# Altium schematic sheet Overview.SchDoc
size A; SheetNumber: 1
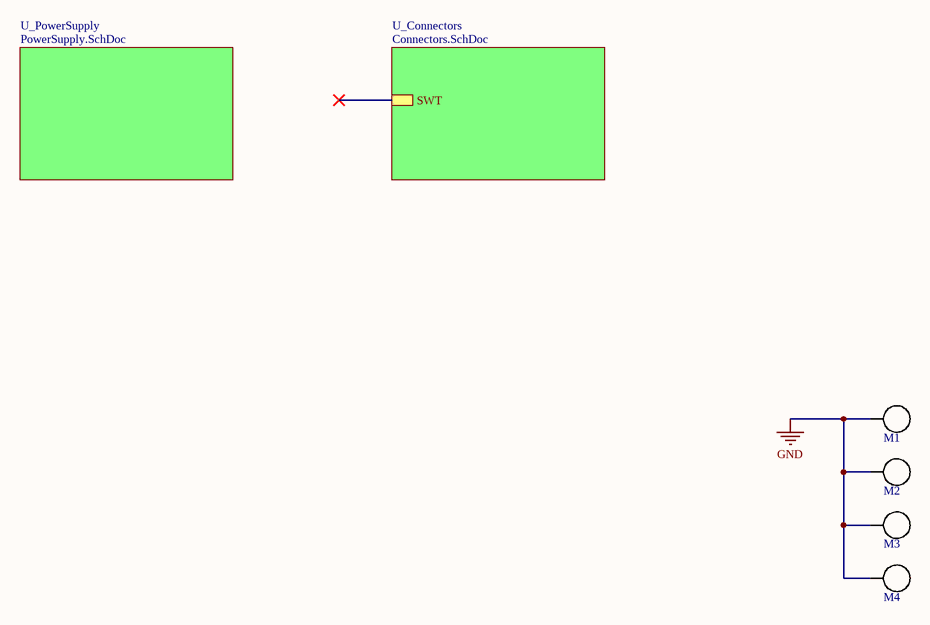
[diagram p0: Overview.SchDoc]

## Parts
M1  TH-MOUNT-5mm_M2.5  [TH-MOUNT-HOLE_5mm_M2.5]  (value not drawn)
M2  TH-MOUNT-5mm_M2.5  [TH-MOUNT-HOLE_5mm_M2.5]  (value not drawn)
M3  TH-MOUNT-5mm_M2.5  [TH-MOUNT-HOLE_5mm_M2.5]  (value not drawn)
M4  TH-MOUNT-5mm_M2.5  [TH-MOUNT-HOLE_5mm_M2.5]  (value not drawn)

## Sub-sheets
U_Connectors = Connectors.SchDoc: SWT
U_PowerSupply = PowerSupply.SchDoc: no entries

## Nets
GND: M1.1 M2.1 M3.1 M4.1